# EAGLE design Versorgung-MAX8881 (EAGLE 4.15)
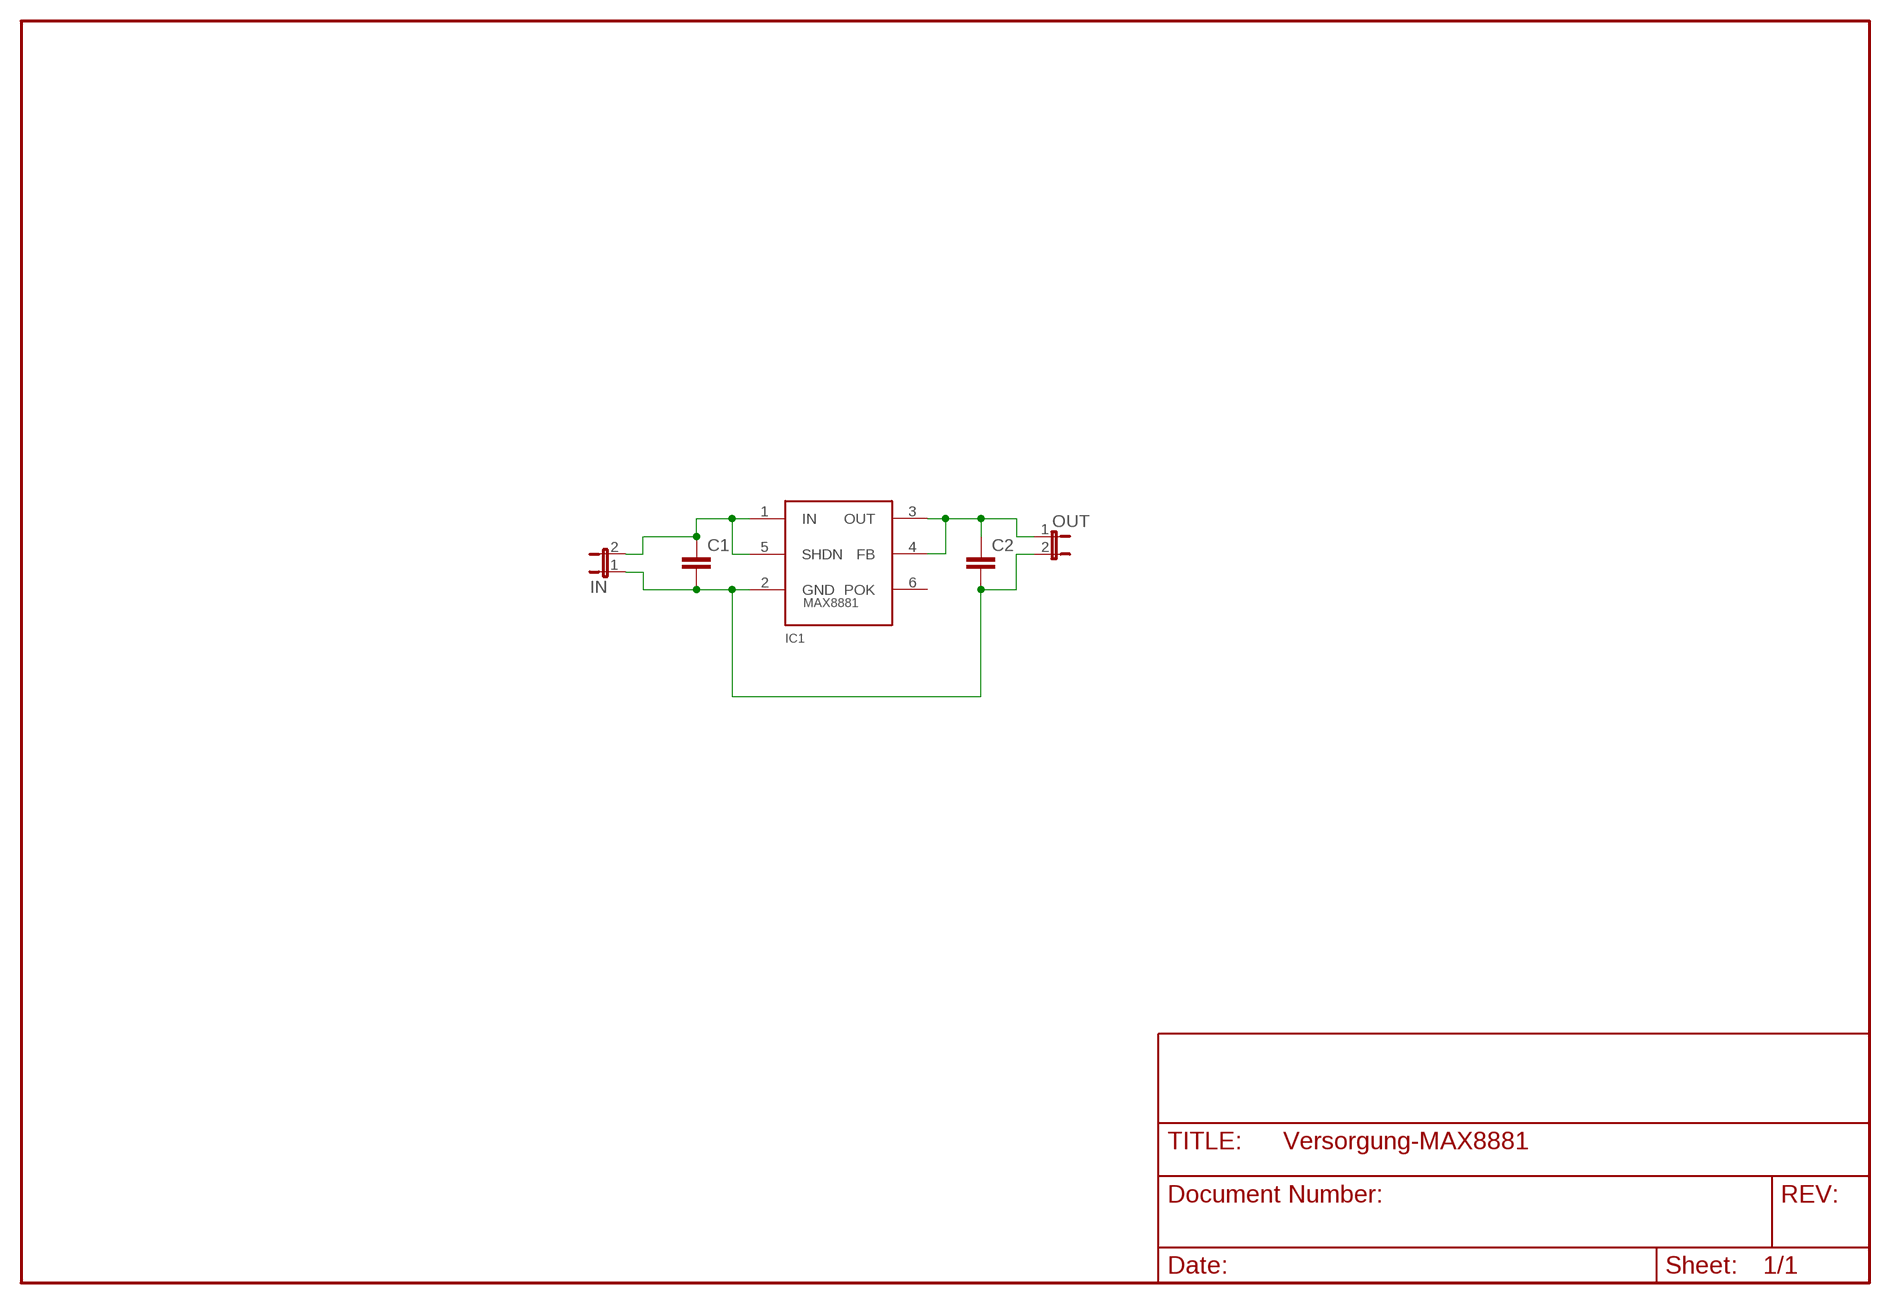
[diagram p0: schematic, sheet 1]

## Parts
C1  C-EUC0805  [C0805]
C2  C-EUC0805  [C0805]
IC1  MAX8881  [SOT23-6L]
IN  JP1E  [JP1]
OUT  JP1E  [JP1]

## Nets
N$1: C1.1 IC1.1(IN) IC1.5(SHDN) IN.2
N$2: C1.2 C2.2 IC1.2(GND) IN.1 OUT.2
N$3: C2.1 IC1.3(OUT) IC1.4(FB) OUT.1
Unconnected: IC1.6(POK)

## Library data of the parts
C1 C2 = turbod3:C-EU: CAPACITOR, European symbol
IC1 = turbod3:MAX8881
IN OUT = jumper:JP1E: JUMPER

## Board
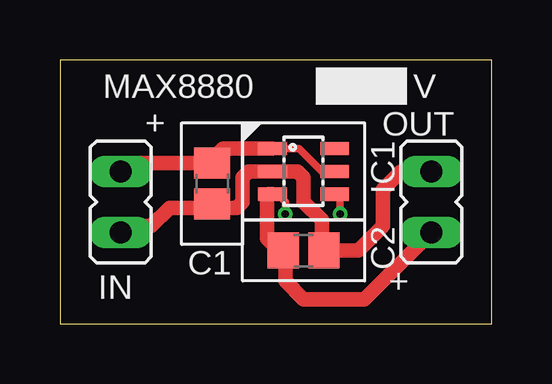
[diagram p1: board, top side]
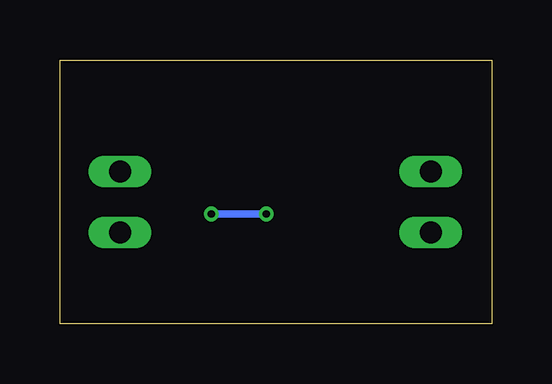
[diagram p2: board, bottom side, seen from below]

Size 18 x 11 mm. Coordinates in mm from the lower left corner, seen from the top.
Outline: 0,0 18,0 18,11 0,11 0,0
Copper layers (1*16): Top 0.035mm / dielectric 1.5mm / Bottom 0.035mm
Design rules "PCB-POOL": minimum track width 6mil, minimum drill 12mil, track to track 6mil, track to pad 6mil, pad to pad 6mil, via to via 6mil, smd to smd 6mil, copper to edge 20mil, drill to drill 8mil, minimum pad ring 8mil, minimum via ring 6mil, stop-mask expansion 3mil, vias tented up to drill 0mil, thermal gap 8mil

### Footprints (pad centres in the part's own frame; a part is rotated, then mirrored left to right if it is on the bottom)
C0805 = smd 1.3 x 1.5: 1 -0.85,0; 2 0.85,0
SOT23-6L = smd 0.55 x 1.2: 1 -0.95,-1.3; 2 0,-1.3; 3 0.95,-1.3; 4 0.95,1.3; 5 0,1.3; 6 -0.95,1.3
JP1 = drill 0.914 long: 1 0,-1.27; 2 0,1.27

### Placement (x,y rotation side)
C1  6.35,5.84 270 top
C2  10.16,3.05 0 top
IC1  10.16,6.35 270 top
IN  2.54,5.08 0 top
OUT  15.49,5.08 0 top

### Tracks (layer width: path | path; a pad name or v marks a point on that pad's centre or on a via)
N$1
  Top 0.305: IC1.1 9.97,7.3 10.92,6.35 IC1.5
  Top 0.61: IC1.1 6.79,7.3 6.35,6.86 C1.1 2.88,6.69 IN.2
N$2
  Top 0.61: 6.52,4.99 6.6,5.08 | 6.52,4.99 C1.2 6.35,4.83 | 6.35,4.83 6.52,4.99 | 6.35,4.83 7.37,4.83 7.62,5.08 7.62,6.1 7.87,6.35 IC1.2 9.91,6.35 10.16,6.1 10.16,5.08 10.92,4.32 10.92,3.05 | 6.35,4.83 4.57,4.83 3.81,4.06 2.79,4.06 IN.1 | OUT.2 14.22,6.35 13.46,5.59 13.46,4.06 12.45,3.05 10.92,3.05 | 10.92,3.05 C2.2
N$3  (via drill 0.3)
  Top 0.305: IC1.4 11.46,5.36 11.68,5.33 v11.68,4.57 | IC1.3 8.86,5.36 | 8.86,5.36 8.89,5.33 | v9.4,4.57 9.4,5.08 9.11,5.36 8.86,5.36
  Top 0.61: OUT.1 12.7,1.02 10.16,1.02 9.4,1.78 9.4,3.05 C2.1 9.14,3.05 8.64,3.56 8.64,5.33 8.7,5.4 IC1.3
  Bottom 0.305: v9.4,4.57 v11.68,4.57

### Text on the board
tNames: MAX8880 | V | + | +